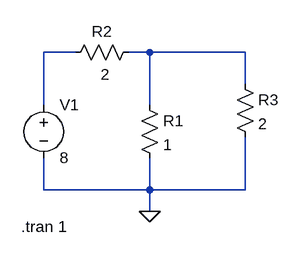
[diagram p0: schematic exe1.asc]
exe1.asc, the LTspice schematic file:
Version 4
SHEET 1 880 680
WIRE 32 192 -16 192
WIRE 144 192 112 192
WIRE 288 192 144 192
WIRE 288 240 288 192
WIRE -16 272 -16 192
WIRE 144 272 144 192
WIRE -16 400 -16 352
WIRE 144 400 144 352
WIRE 144 400 -16 400
WIRE 288 400 288 320
WIRE 288 400 144 400
WIRE 144 432 144 400
FLAG 144 432 0
SYMBOL voltage -16 256 R0
WINDOW 123 0 0 Left 0
WINDOW 39 0 0 Left 0
SYMATTR InstName V1
SYMATTR Value 8
SYMBOL res 128 256 R0
SYMATTR InstName R1
SYMATTR Value 1
SYMBOL res 128 176 R90
WINDOW 0 0 56 VBottom 2
WINDOW 3 34 51 VTop 2
SYMATTR InstName R2
SYMATTR Value 2
SYMBOL res 272 224 R0
SYMATTR InstName R3
SYMATTR Value 2
TEXT -50 456 Left 2 !.tran 1

The netlist it stands for:
* exe1.asc
V1 N001 0 8
R1 N002 0 1
R2 N002 N001 2
R3 N002 0 2
.tran 1
.backanno
.end